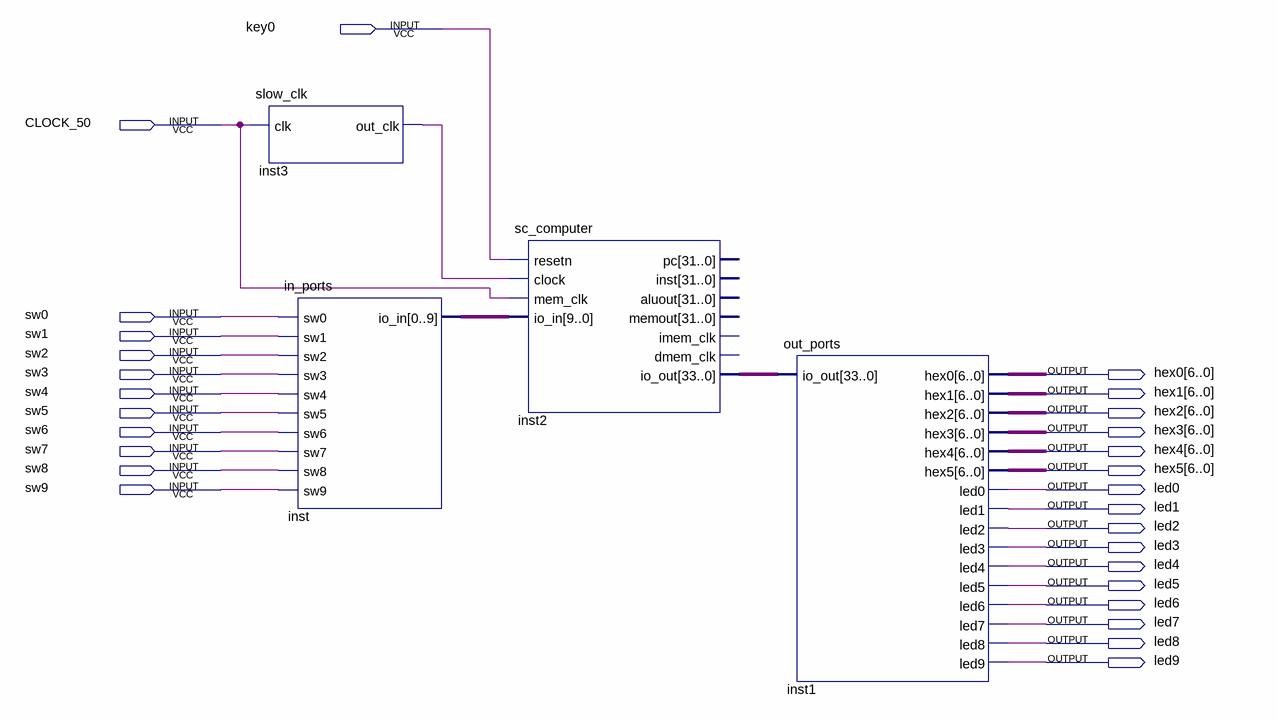
[diagram p0: schematic sheet]
// Quartus schematic my_sc_computer.bdf as structural Verilog: 4 symbols, 28 pins
module my_sc_computer (
  input  key0,
  input  CLOCK_50,
  input  sw0,
  input  sw1,
  input  sw2,
  input  sw3,
  input  sw4,
  input  sw5,
  input  sw6,
  input  sw7,
  input  sw8,
  input  sw9,
  output [6:0] hex0,
  output [6:0] hex1,
  output [6:0] hex2,
  output [6:0] hex3,
  output [6:0] hex4,
  output [6:0] hex5,
  output led0,
  output led1,
  output led2,
  output led3,
  output led4,
  output led5,
  output led6,
  output led7,
  output led8,
  output led9
);

  wire inst3_out_clk;
  wire [9:0] inst_io_in;
  wire [33:0] inst2_io_out;

  slow_clk inst3 (.clk(CLOCK_50), .out_clk(inst3_out_clk));
  in_ports inst (
    .sw0(sw0), .sw1(sw1), .sw2(sw2), .sw3(sw3), .sw4(sw4), .sw5(sw5), .sw6(sw6), .sw7(sw7), .sw8(sw8),
    .sw9(sw9), .io_in(inst_io_in));
  sc_computer inst2 (
    .resetn(key0), .clock(inst3_out_clk), .mem_clk(CLOCK_50), .io_in(inst_io_in), .io_out(inst2_io_out));  // open: pc, inst, aluout, memout, imem_clk, dmem_clk
  out_ports inst1 (
    .io_out(inst2_io_out), .hex0(hex0), .hex1(hex1), .hex2(hex2), .hex3(hex3), .hex4(hex4), .hex5(hex5),
    .led0(led0), .led1(led1), .led2(led2), .led3(led3), .led4(led4), .led5(led5), .led6(led6), .led7(led7),
    .led8(led8), .led9(led9));
endmodule
